# Altium schematic sheet Car_Peripherals.SchDoc: Wacky Vehicle Peripherals
size A3; DrawnBy: K. Carden, O. Anainga; Organization: Group 2; Address1: ECE Department; Address2: University of Canterbury; Address3: Christchurch 8041; Address4: New Zealand; Revision: 1; SheetNumber: 2; SheetTotal: 3; ImagePath: C:\Users\Public\Documents\Altium\AD23\Templates\UC_Templates\uc-logo.png
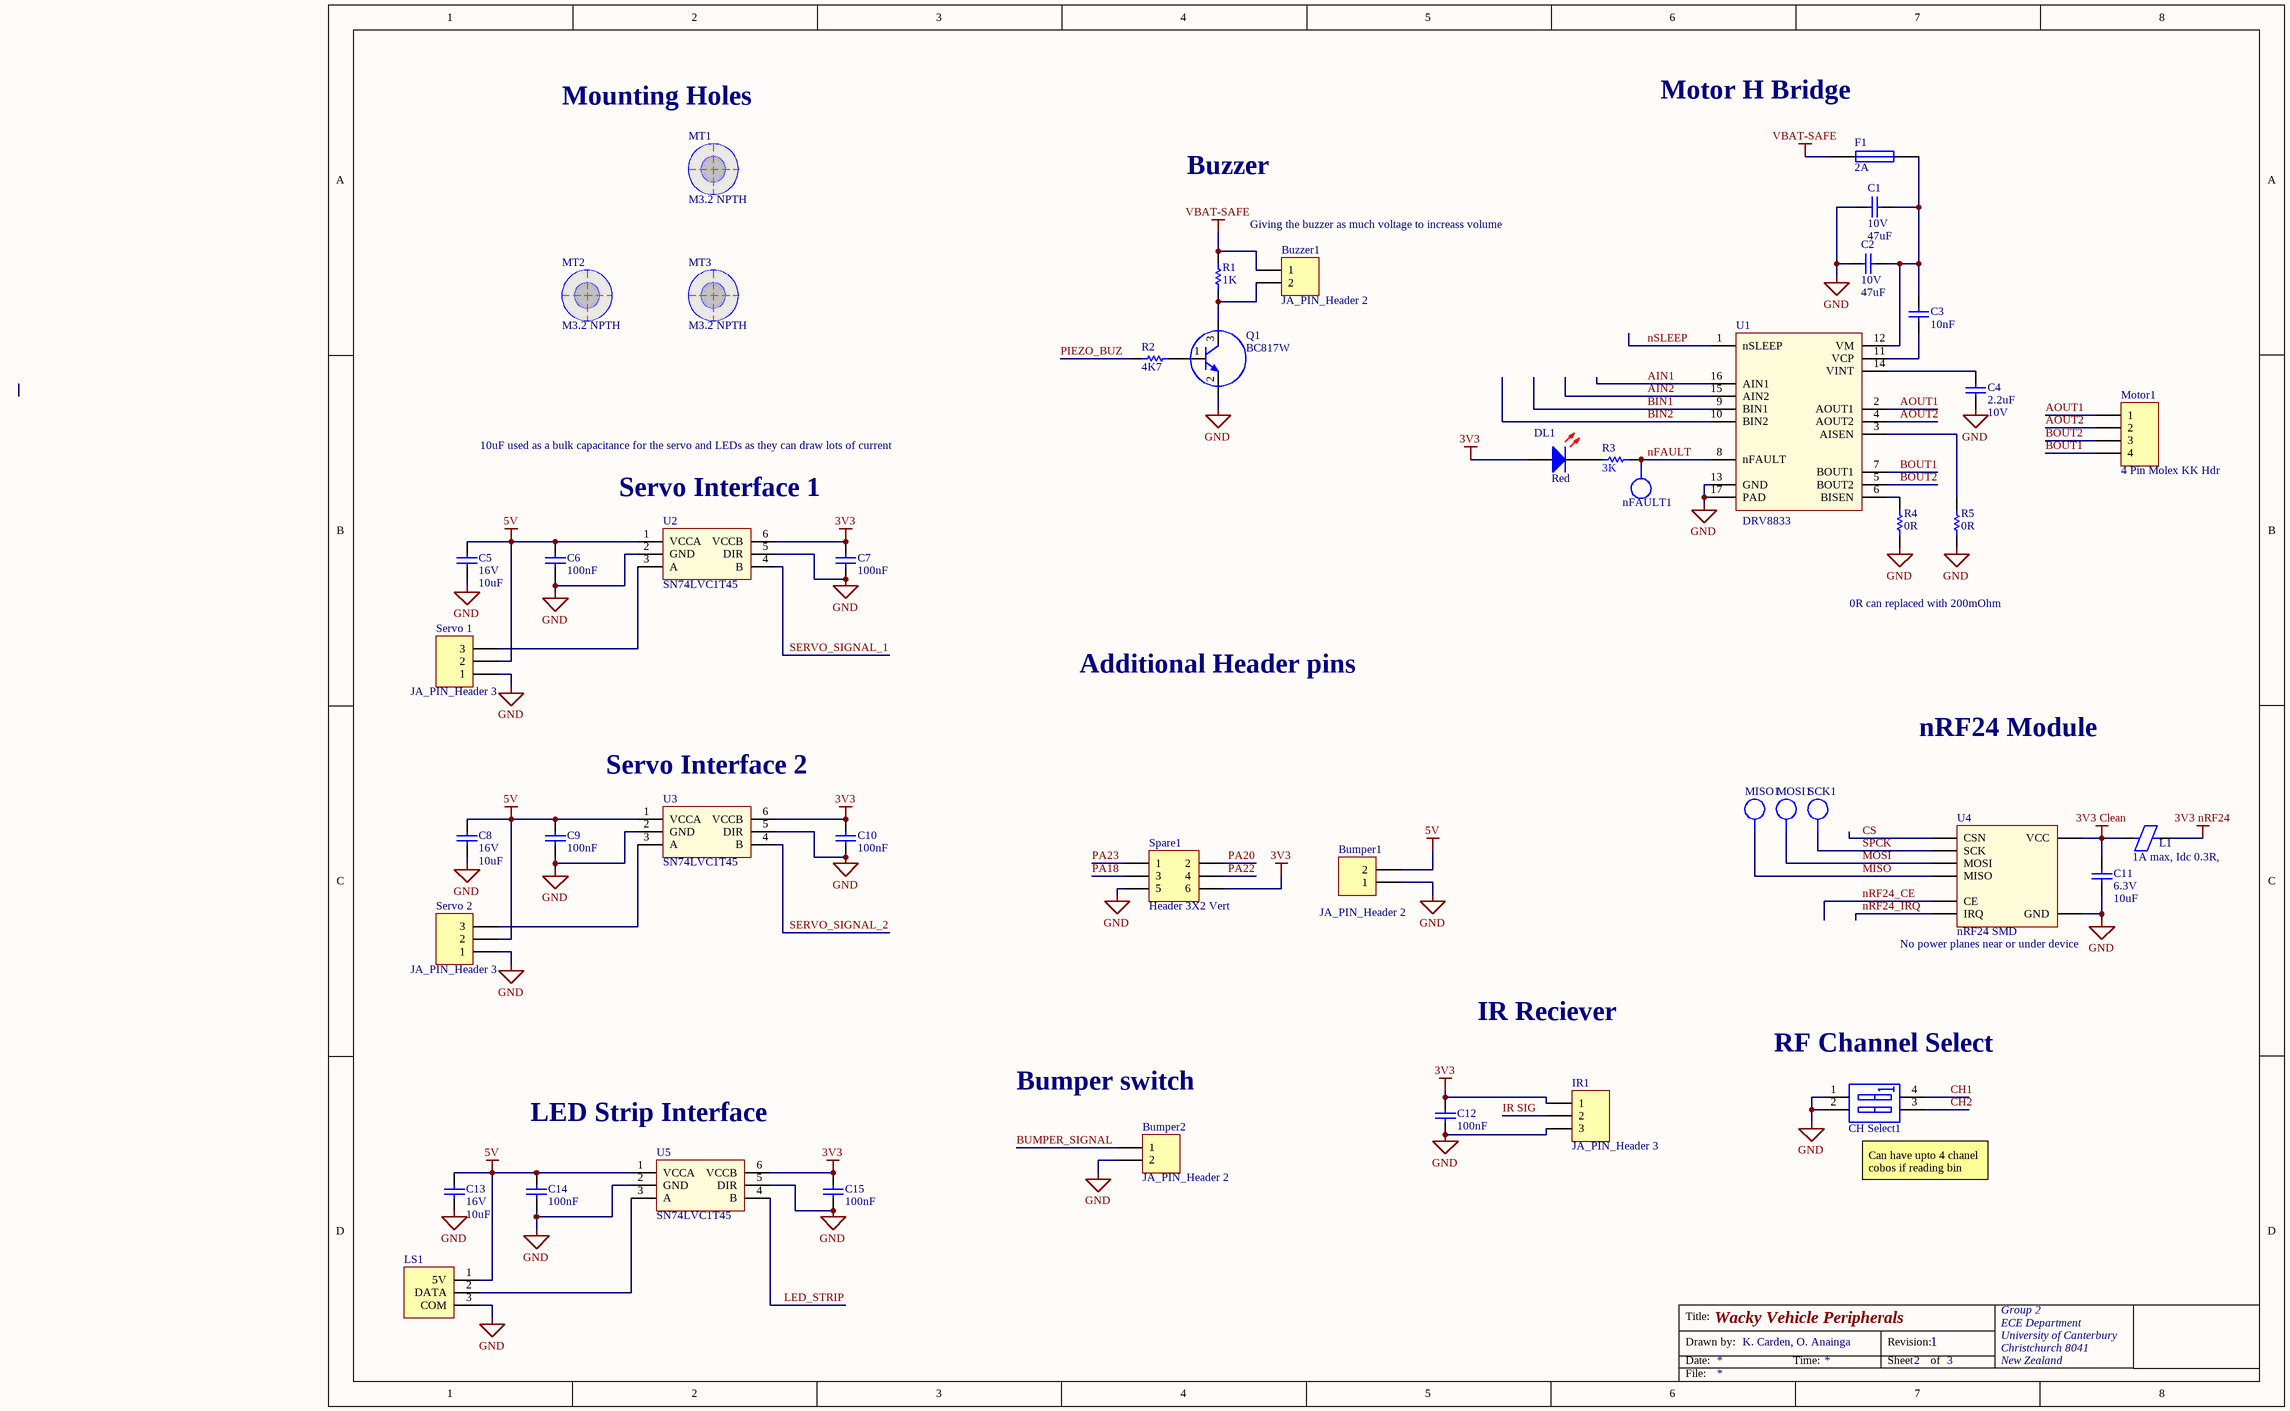
[diagram p0: Car_Peripherals.SchDoc]

## Parts
Bumper1  JA_PIN_Header 2  [HDR1X2]
Bumper2  JA_PIN_Header 2  [HDR1X2]
Buzzer1  JA_PIN_Header 2  [HDR1X2]
C1  Max Voltage: 10V  [CAPC3216L]  (hidden comment: 47uF)
C2  Max Voltage: 10V  [CAPC3216L]  (hidden comment: 47uF)
C3  10nF  [CAPC1608L]
C4  Max Voltage: 10V  [CAPC1608L]  (hidden comment: 2.2uF)
C5  Voltage - Rated: 16V  [CAPC2012L]  (hidden comment: 10uF)
C6  100nF  [CAPC1608L]
C7  100nF  [CAPC1608L]
C8  Voltage - Rated: 16V  [CAPC2012L]  (hidden comment: 10uF)
C9  100nF  [CAPC1608L]
C10  100nF  [CAPC1608L]
C11  Voltage - Rated: 6.3V  [CAPC1608L]  (hidden comment: 10uF)
C12  100nF  [CAPC1608L]
C13  Voltage - Rated: 16V  [CAPC2012L]  (hidden comment: 10uF)
C14  100nF  [CAPC1608L]
C15  100nF  [CAPC1608L]
CH_Select1  WS_SW DIP-2  [DIP_SW_2WAY_SMD]  (value not drawn)
DL1  Red  [WL-SMCW0603]
F1  2A  [RESC3216N]
IR1  JA_PIN_Header 3  [HDR1X3]
L1  1A max, Idc 0.3R,  [INDC3216L]
LS1  3 Pin Molex KK Hdr  [MOLEX_KK_3_HDR]  (value not drawn)
MISO1  (no value)  [TP_1206]  (no BOM)
MOSI1  (no value)  [TP_1206]  (no BOM)
Motor1  4 Pin Molex KK Hdr  [MOLEX_KK_4_HDR]
MT1  M3.2 NPTH  [MNT-HOLE_3.2mm_NPTH]  (no BOM)
MT2  M3.2 NPTH  [MNT-HOLE_3.2mm_NPTH]  (no BOM)
MT3  M3.2 NPTH  [MNT-HOLE_3.2mm_NPTH]  (no BOM)
nFAULT1  (no value)  [TP_1206]  (no BOM)
Q1  BC817W  [SOT323_M]
R1  1K  [RESC1608L]
R2  4K7  [RESC1608L]
R3  3K  [RESC1608L]
R4  0R  [RESC3216L]
R5  0R  [RESC3216L]
SCK1  (no value)  [TP_1206]  (no BOM)
Servo_1  JA_PIN_Header 3  [HDR1X3]
Servo_2  JA_PIN_Header 3  [HDR1X3]
Spare1  Header 3X2 Vert  [IDC2.54-V06D]
U1  DRV8833  [HTSOP16 DRV8833]
U2  SN74LVC1T45  [SOT23-6_N]
U3  SN74LVC1T45  [SOT23-6_N]
U4  nRF24 SMD  Warning: No power planes near or under device  [NRF24]
U5  SN74LVC1T45  [SOT23-6_N]

## Nets
3V3: C7.2 C10.2 C12.2 C15.2 DL1.2(A) IR1.1 Spare1.6 U2.6(VCCB) U3.6(VCCB) U5.6(VCCB)
3V3 Clean: C11.2 L1.2 U4.1(VCC)
3V3 nRF24: L1.1
5V: Bumper1.2 C5.2 C6.2 C8.2 C9.2 C13.2 C14.2 LS1.1(5V) Servo_1.2 Servo_2.2 U2.1(VCCA) U3.1(VCCA) U5.1(VCCA)
GND: Bumper1.1 Bumper2.2 C1.2 C2.2 C4.1 C5.1 C6.1 C7.1 C8.1 C9.1 C10.1 C11.1 C12.1 C13.1 C14.1 C15.1 CH_Select1.1(A1) CH_Select1.2(A2) IR1.3 LS1.3(COM) Q1.2 R4.1 R5.1 Servo_1.1 Servo_2.1 Spare1.5 U1.13(GND) U1.17(PAD) U2.2(GND) U2.5(DIR) U3.2(GND) U3.5(DIR) U4.2(GND) U5.2(GND) U5.5(DIR)
VBAT-SAFE: Buzzer1.1 F1.1 R1.2
AIN1: U1.16(AIN1)
AIN2: U1.15(AIN2)
AOUT1: Motor1.1 U1.2(AOUT1)
AOUT2: Motor1.2 U1.4(AOUT2)
BIN1: U1.9(BIN1)
BIN2: U1.10(BIN2)
BOUT1: Motor1.4 U1.7(BOUT1)
BOUT2: Motor1.3 U1.5(BOUT2)
BUMPER_SIGNAL: Bumper2.1
CH1: CH_Select1.4(B1)
CH2: CH_Select1.3(B2)
CS: U4.4(CSN)
IR SIG: IR1.2
LED_STRIP: U5.4(B)
MISO: MISO1.1 U4.7(MISO)
MOSI: MOSI1.1 U4.6(MOSI)
nFAULT: nFAULT1.1 R3.2 U1.8(nFAULT)
nRF24_CE: U4.3(CE)
nRF24_IRQ: U4.8(IRQ)
nSLEEP: U1.1(nSLEEP)
PA18: Spare1.3
PA20: Spare1.2
PA22: Spare1.4
PA23: Spare1.1
PIEZO_BUZ: R2.1
SERVO_SIGNAL_1: U2.4(B)
SERVO_SIGNAL_2: U3.4(B)
SPCK: SCK1.1 U4.5(SCK)
NetBuzzer1_2: Buzzer1.2 Q1.3 R1.1
NetC1_1: C1.1 C2.1 C3.2 F1.2 U1.12(VM)
NetC3_1: C3.1 U1.11(VCP)
NetC4_2: C4.2 U1.14(VINT)
NetDL1_1: DL1.1(K) R3.1
NetLS1_2: LS1.2(DATA) U5.3(A)
NetQ1_1: Q1.1 R2.2
NetR4_2: R4.2 U1.6(BISEN)
NetR5_2: R5.2 U1.3(AISEN)
NetServo_1_3: Servo_1.3 U2.3(A)
NetServo_2_3: Servo_2.3 U3.3(A)

## Notes on the sheet
- Motor H Bridge
- Mounting Holes
- Buzzer
- Giving the buzzer as much voltage to increass volume
- 10uF used as a bulk capacitance for the servo and LEDs as they can draw lots of current
- Servo Interface 1
- 0R can replaced with 200mOhm
- Additional Header pins
- Servo Interface 2
- nRF24 Module
- IR Reciever
- (near CH_Select1) RF Channel Select
- Bumper switch
- LED Strip Interface
- (near CH_Select1) Can have upto 4 chanel cobos if reading bin
- Title:
- Drawn by:
- Date:
- Time:
- Revision:
- Sheet
- of
- File:

## Library data of the parts
Bumper1 Bumper2 Buzzer1 = JA_PIN_Header 2: Header, 2-Pin; LatestRevisionDate: 17-Jul-2002; LatestRevisionNote: Re-released for DXP Platform.; Publisher: Altium Limited
C1 C2 = CC_47uF_1206: CAP CER 47uF X5R -/+20% 10V 1206; Verify: *; Supplier: ECE Dept; Storage Location: PCB Assembly WS; Dielectric: X5R; Footprint: 1210 (3225 metric); MoV: 10V; Value: 47uF
C3 = CC_10nF_0603: CAP CER 10nF X7R +-10% 50V 0603; PackageReference: 0603; Code_IPC: 1608 [0603]; Verify: *; Supplier: ECE Dept; Storage Location: PCB Assembly WS; Value: 10nF
C4 = CC_2.2uF_0603: CAP CER 2.2uF X5R +-20% 10V 0603; PackageReference: 0603; Code_IPC: 1608 [0603]; Verify: *; Supplier: ECE Dept; Storage Location: PCB Assembly WS; Value: 2.2uF
C5 C8 C13 = CC_10uF_0805_16V: CAP CER 10uF X5R 16V 0805; Manufacturer: Samsung Electro-Mechanics; Manufacturer Part Number: CL21A106KOQNNWE; Note: Footprint corresponds to dimensions for bulk cassette packaging. This case size has tightened tolerances.; Tolerance: ±10%; Notification: Current market demand for these product types have resulted in fluctuating and extending lead times. Lead times may differ.; PackageReference: 0805; Code_IPC: 2012[0805]; Supplier 1: Digi-Key; RoHS: RoHS Compliant; Category: Capacitors; Stock 1: 20000; Pricing 1: 1=0.35, 10=0.25, 100=0.1178, 500=0.08254, 1000=0.06831 (NZD); Packaging: Cut Tape (CT); Part Status: Active; Temperature Coefficient: X5R; Operating Temperature: -55°C ~ 85°C; Features: -; Ratings: -; Applications: General Purpose; Mounting Type: Surface Mount, MLCC; Package / Case: 0805 (2012 Metric); Size / Dimension: 0.079" L x 0.049" W (2.00mm x 1.25mm); Height - Seated (Max): -; Thickness (Max): 0.055" (1.40mm); Lead Spacing: -; Lead Style: -; ComponentLink1URL: http://www.samsungsem.com/kr/support/product-search/mlcc/CL21A106KOQNNWE.jsp; ComponentLink1Description: http://www.samsungsem.com/kr/support/product-search/mlcc/CL21A106KOQNNWE.jsp; Supplier Part Number 1: 1276-2894-1-ND; Value: 10uF
C6 C7 C9 C10 C12 C14 C15 = CC_100nF_0603: CAP CER 100nF X7R +-10% 50V 0603; PackageReference: 0603; Code_IPC: 1608 [0603]; Verify: *; Supplier: ECE Dept; Storage Location: PCB Assembly WS; Value: 100nF
C11 = CC_10uF_0603: CAP CER 10UF X5R +-20% 6V3 0603; Supplier: ECE Dept; Storage Location: PCB Assembly WS; Value: 10uF
CH_Select1 = WS_SW DIP-2: DIP Switch, 2 Position, SPST SMD; Manufacturer: OMRON ELECTRONIC COMPONENTS; Manufacturer Part Number: A6SN-2101; Contact Current DC Max: 25; External Length / Height: 7; No. of Switch Positions: 2; Pitch Spacing: 2.54; PackageReference: DIP-4; Contact Configuration: SPST; Supplier 1: Farnell; Supplier Part Number 1: 2029424; Storage Location: PCB Assembly WS; Supplier: ECE Dept
DL1 = DL_150060RS75000: LED Red 250mcd 0603 SMD; Manufacturer: WURTH ELEKTRONIK; Forward Current If: 30; Forward Voltage: 2; Lens Shape: Rectangular; Luminous Intensity: 250; Wavelength Typ: 625; Viewing Angle: 140°; LED Mounting: SMD; Supplier 1: Farnell; Supplier Part Number 1: 2322071; Manufacturer Part Number: 150060RS75000; Storage Location: PCB Assembly WS; Supplier: ECE Dept; LED Colour: Red
F1 = FS_Fuse_2.0A: Fuse 2.0A Very Fast Acting 1206 SMD; Manufacturer: MULTICOMP; Manufacturer PN: MC12CF 002; Supplier: ECE Dept; Storage Location: PCB Assembly WS; Supplier 1: Farnell; Supplier Part Number 1: 1841029; Manufacturer Part Number: MC12CF 002; Value: 2A
IR1 Servo_1 Servo_2 = JA_PIN_Header 3: Header, 3-Pin; LatestRevisionDate: 17-Jul-2002; LatestRevisionNote: Re-released for DXP Platform.; Publisher: Altium Limited
L1 = IN_Ferrite-Bead: Ferrite Bead, Rdc 0.3R, Z100MHZ 600R, Imax 1A, SMD 1206; Manufacturer: FAIR-RITE; Manufacturer PN: 2512066017Y1; DC Current Rating: 1; DC Resistance Max: 0.08; Ferrite Case Style: 1206 ^3216 Metric]; Frequency Range: 50MHz to 1; Impedance: 600; Impedance Tolerance: ± 25%; Supplier: ECE Dept; Storage Location: PCB Assembly WS; Ferrite Mounting: SMD; Supplier 1: Farnell; Supplier Part Number 1: 1612060; Manufacturer Part Number: 2512066017Y1; Value: 1A max, Idc 0.3R,
LS1 = LED_Strip_Header: CONN HEADER 3POS 2.54mm VERT_Thru Hole; Manufacturer: Molex; Manufacturer PN: 22-23-2031; Supplier Part Number 1: 9731156; Supplier: ECE Dept; Supplier 1: Farnell; Storage Location: ECE Dept Store; Value: 3 Pin Molex KK Hdr
MISO1 MOSI1 nFAULT1 SCK1 = TP_1206: Test-Point 3.3x1.6x2.1mm SMD; Manufacturer: Harwin Inc; Manufacturer Part Number: S1751-46R; Value: TP; Manufacturer PN: *; Storage Location: ProtoPlace; Mounting Type: Surface Mount; Type: PC Test Point; Supplier 1: Digi-Key; Supplier Part Number 1: 952-1478-2-ND; Supplier 2: Farnell; Supplier Part Number 2: 1826282; Supplier: ECE Dept
Motor1 = JA_MOLEX_KK_4POS: CONN HEADER 4POS 2.54mm VERT_Thru Hole; Manufacturer: Molex; Manufacturer PN: 22-23-2041; Supplier Part Number 1: 9731164; Supplier: ECE Dept; Supplier 1: Farnell; Storage Location: ECE Dept Store; Value: 4 Pin Molex KK Hdr
MT1-MT3 = MC_M3.2_HOLE: Fixing M3.2 Mount Hole NPTH; Manufacturer: Hi-Q; Manufacturer PN: 3BV series M3 Clearance; price: 0; Supplier: ECE Dept; value: M3.2 NPTH
Q1 = TB_BC817W: NPN GP Bipolar Transistor 45V 500mA SOT323; Manufacturer: NXP; Supplier 1: Farnell; Supplier Part Number 1: 2114873; Manufacturer PN: BC817W; Storage Location: PCB Assembly WS; Supplier: ECE Dept; Supplier 2: Digi-Key; Value: BC817W; Supplier Part Number 2: 1727-4843-1-ND
R1 = RS_1K: RES 1.0K OHM 1/10W 5% 0603 SMD; Storage Location: PCB Assembly WS; Supplier: ECE Dept; Value: 1K
R2 = RS_4K7: RES 4.7K OHM 1/10W 5% 0603 SMD; Storage Location: PCB Assembly WS; Supplier: ECE Dept; Value: 4K7
R3 = RS_3K: RES 3K OHM 1/10W 5% 0603 SMD; Storage Location: PCB Assembly WS; Supplier: ECE Dept; Value: 3K
R4 R5 = RT_0R: RES 0R OHM 1/8W 5% 1206 SMD; Storage Location: PCB Assembly WS; Supplier: ECE Dept; Value: 0R
Spare1 = JA_HDR_IDC_3X2_VERT: IDC Header, 2,54mm, 6-Pin, Vert; Manufacturer: Amphenol FCI; Manufacturer Part Number: 75869-131LF; Number of Positions: 6; Max Voltage Rating (AC): 500V; Connector Type: Male Pin; Current Rating: 3A; Gender: Male; Max Current Rating: 2A; Pitch: 2.54mm; Row Spacing: 0.1inch; Mating Post Length: 6mm; Supplier: ECE Dept; Storage Location: ECE Dept Store; Supplier 1: Digi-Key; Supplier 2: Element14; Stock 1: 21632; Pricing 1: 1=0.74, 10=0.697, 100=0.5345, 500=0.4648, 1000=0.38346, 5000=0.33698, 10000=0.31374 (USD); Mount: Through Hole; Contact Plating: Gold,GXT; Contact Material: Bronze,Copper Alloy; Colour: Blue; Housing Colour: Blue; Housing Material: Thermoplastic; Min Operating Temperature: -65°C; Max Operating Temperature: 125°C; Number of Rows: 2; Packaging: Rail/Tube; Package Quantity: 100; Termination: Solder; Number of Contacts: 6; Orientation: Straight; Contact Gender: Male; Voltage Rating: 500V; Length: 14.83mm; Height: 27.2mm; Depth: 9.55mm; Termination Post Length: 3.05mm; Contact Mating Length: 0.236inch; Radiation Hardening: No; Lead Free: Lead Free; REACH SVHC: No SVHC; ComponentLink1URL: https://datasheet.ciiva.com/16656/75869-16656678.pdf; ComponentLink1Description: https://datasheet.ciiva.com/16656/75869-16656678.pdf; ComponentLink2URL: https://datasheet.ciiva.com/5722/75869-5722919.pdf; ComponentLink2Description: https://datasheet.ciiva.com/5722/75869-5722919.pdf; ComponentLink3URL: https://datasheet.ciiva.com/9465/75869-9465975.pdf; ComponentLink3Description: https://datasheet.ciiva.com/9465/75869-9465975.pdf; ComponentLink4URL: https://datasheet.ciiva.com/11748/0900766b80d79252-11748151.pdf; ComponentLink4Description: https://datasheet.ciiva.com/11748/0900766b80d79252-11748151.pdf; ComponentLink5URL: https://datasheet.ciiva.com/719/75869-719692.pdf; ComponentLink5Description: https://datasheet.ciiva.com/719/75869-719692.pdf; ComponentLink6URL: https://datasheet.ciiva.com/8046/75869-8046653.pdf; ComponentLink6Description: https://datasheet.ciiva.com/8046/75869-8046653.pdf; ComponentLink7URL: https://datasheet.ciiva.com/22644/1688107-22644798.pdf; ComponentLink7Description: https://datasheet.ciiva.com/22644/1688107-22644798.pdf; Supplier Part Number 1: 609-2845-ND; Supplier Part Number 2: 2293757
U1 = DRV8833: Dual H-Bridge Motor Driver 1.5A; ComponentLink1Description: DRV8833 Datasheet; ComponentLink1URL: \\maxwell\elecapp\AltiumDesigner\Libraries\DatasheetsNew\ENCE461\drv8833pwpr.pdf
U2 U3 U5 = SN74LVC1T45: 1.8V - 5V level converter
U4 = NRF24: nRF24 SMD Module